# Altium schematic sheet RS485_RS232_Sheet.SchDoc
size 420 x 297 mm; SheetNumber: 5; SheetTotal: 10
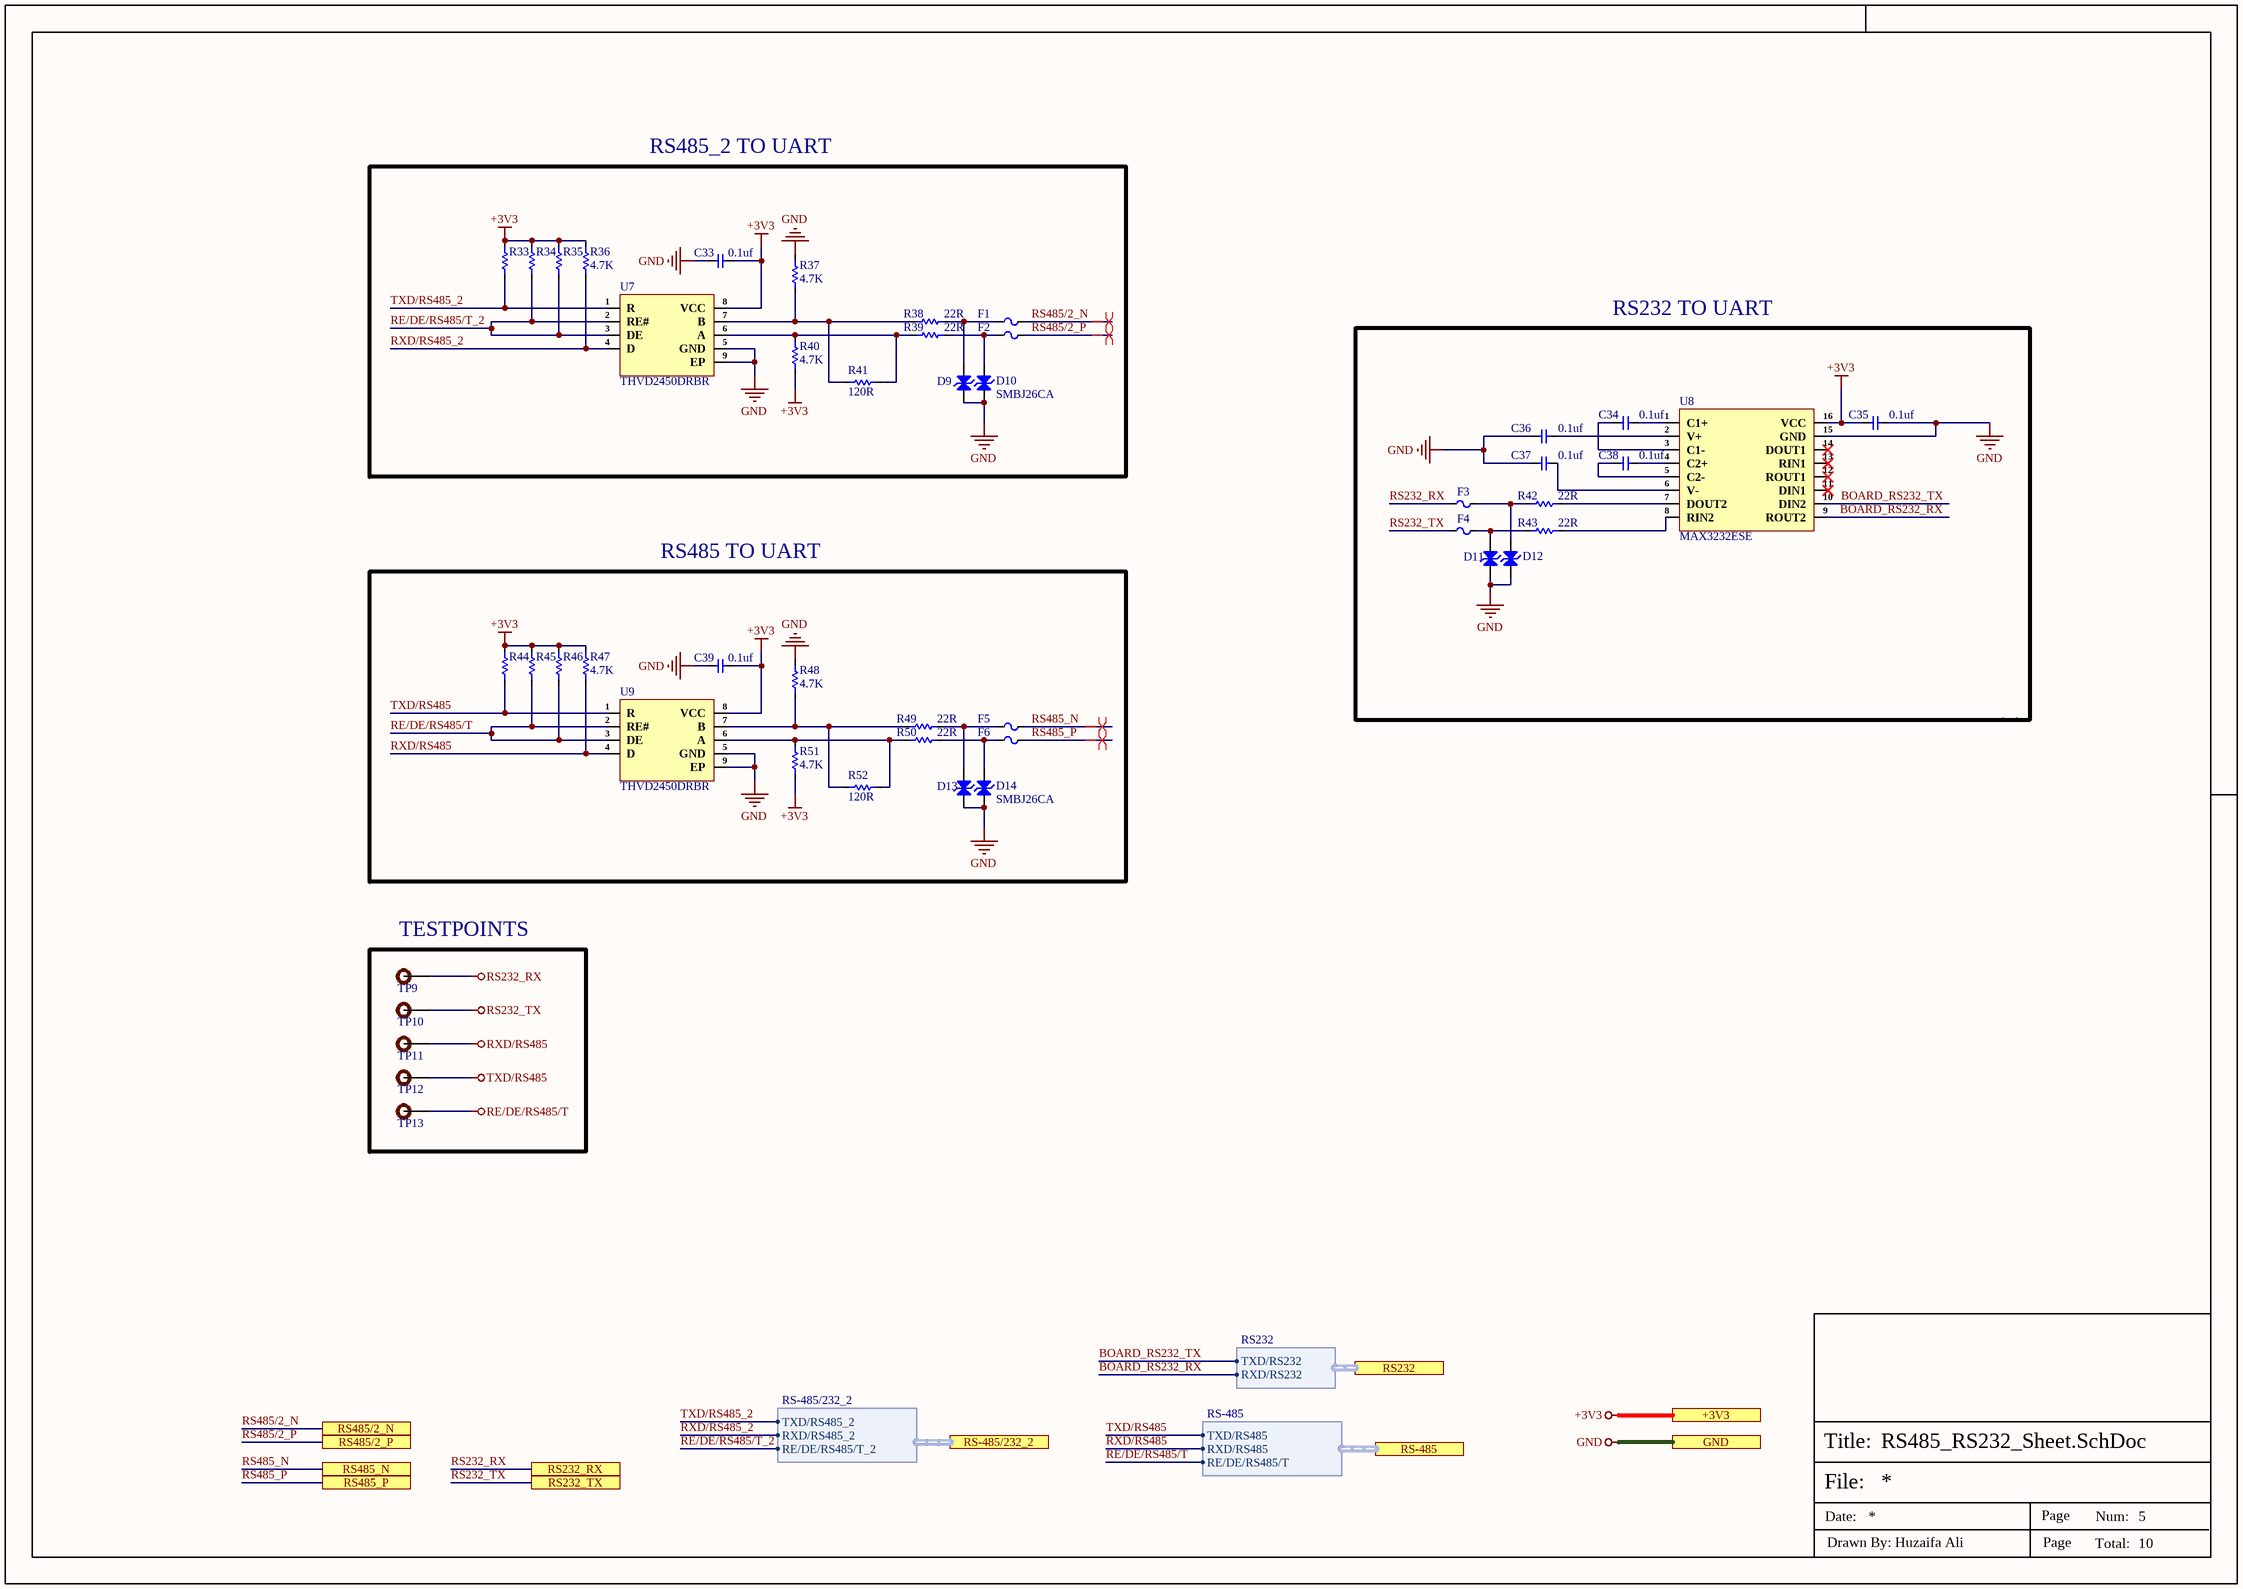
[diagram p0: RS485_RS232_Sheet.SchDoc]

## Parts
C33  0.1uf  [Cap-0402]
C34  0.1uf  [Cap-0402]
C35  0.1uf  [Cap-0402]
C36  0.1uf  [Cap-0402]
C37  0.1uf  [Cap-0402]
C38  0.1uf  [Cap-0402]
C39  0.1uf  [Cap-0402]
D9  SMBJ26CA  [SMB Bi Directional]  (value not drawn)
D10  SMBJ26CA  [SMB Bi Directional]
D11  SMBJ26CA  [SMB Bi Directional]  (value not drawn)
D12  SMBJ26CA  [SMB Bi Directional]  (value not drawn)
D13  SMBJ26CA  [SMB Bi Directional]  (value not drawn)
D14  SMBJ26CA  [SMB Bi Directional]
F1  SMD0805P020TF  [Fuse-0805]  (value not drawn)
F2  SMD0805P020TF  [Fuse-0805]  (value not drawn)
F3  SMD0805P020TF  [Fuse-0805]  (value not drawn)
F4  SMD0805P020TF  [Fuse-0805]  (value not drawn)
F5  SMD0805P020TF  [Fuse-0805]  (value not drawn)
F6  SMD0805P020TF  [Fuse-0805]  (value not drawn)
R33  4.7K  [Res-0402]  (value not drawn)
R34  4.7K  [Res-0402]  (value not drawn)
R35  4.7K  [Res-0402]  (value not drawn)
R36  4.7K  [Res-0402]
R37  4.7K  [Res-0402]
R38  22R  [Res-0201]
R39  22R  [Res-0201]
R40  4.7K  [Res-0402]
R41  120R  [Res-0603]
R42  22R  [Res-0201]
R43  22R  [Res-0201]
R44  4.7K  [Res-0402]  (value not drawn)
R45  4.7K  [Res-0402]  (value not drawn)
R46  4.7K  [Res-0402]  (value not drawn)
R47  4.7K  [Res-0402]
R48  4.7K  [Res-0402]
R49  22R  [Res-0201]
R50  22R  [Res-0201]
R51  4.7K  [Res-0402]
R52  120R  [Res-0603]
TP9  TEST POINT  [Test-point]  (value not drawn)  (no BOM)
TP10  TEST POINT  [Test-point]  (value not drawn)  (no BOM)
TP11  TEST POINT  [Test-point]  (value not drawn)  (no BOM)
TP12  TEST POINT  [Test-point]  (value not drawn)  (no BOM)
TP13  TEST POINT  [Test-point]  (value not drawn)  (no BOM)
U7  THVD2450DRBR  [SON-8-EP(3x3)]
U8  MAX3232ESE  [SOP-16]
U9  THVD2450DRBR  [SON-8-EP(3x3)]

## Ports
+3V3 (see Top_Sheet[3B], CAN_Sheet[5D], Controller_Sheet[5D], EtherCAT_Sheet[5D], Power_Sheet[5D], RJ45_Sheet[5D]), GND (see Top_Sheet[3C], CAN_Sheet[5D], Connector_Sheet[5D], Controller_Sheet[5D], EtherCAT_Sheet[5D], Power_Sheet[5D], Relay_Sheet[5D], RJ45_Sheet[5D]), RS232 (harness RS232, see Top_Sheet[4B], Controller_Sheet[4D]), RS232_RX (see Top_Sheet[4C], Connector_Sheet[2D]), RS232_TX (see Top_Sheet[4C], Connector_Sheet[2D]), RS485/2_N (see Top_Sheet[3C], Connector_Sheet[2D]), RS485/2_P (see Top_Sheet[3C], Connector_Sheet[2D]), RS485_N (see Top_Sheet[4C], Connector_Sheet[2D]), RS485_P (see Top_Sheet[4C], Connector_Sheet[2D]), RS-485 (harness RS-485, see Top_Sheet[4C], Controller_Sheet[4D]), RS-485/232_2 (harness RS-485/232_2, see Top_Sheet[4C], Controller_Sheet[3D])

## Harnesses
RS-485: TXD/RS485, RXD/RS485, RE/DE/RS485/T
RS-485/232_2: TXD/RS485_2, RXD/RS485_2, RE/DE/RS485/T_2
RS232: TXD/RS232, RXD/RS232

## Nets
+3V3: C33.2 C35.2 C39.2 R33.2 R34.2 R35.2 R36.2 R40.1 R44.2 R45.2 R46.2 R47.2 R51.1 U7.8(VCC) U8.16(VCC) U9.8(VCC) ; port +3V3
GND: C33.1 C35.1 C36.1 C37.1 C39.1 D9.1(A) D10.1(A) D11.1(A) D12.1(A) D13.1(A) D14.1(A) R37.2 R48.2 U7.5(GND) U7.9(EP) U8.15(GND) U9.5(GND) U9.9(EP) ; port GND
RE/DE/RS485/T: R45.1 R46.1 TP13.1 U9.2(RE#) U9.3(DE) ; port RS-485.RE/DE/RS485/T
RS232_RX: F3.1 TP9.1 ; port RS232_RX
RS232_TX: F4.1 TP10.1 ; port RS232_TX
RXD/RS485: R47.1 TP11.1 U9.4(D) ; port RS-485.RXD/RS485
TXD/RS485: R44.1 TP12.1 U9.1(R) ; port RS-485.TXD/RS485
BOARD_RS232_RX: U8.9(ROUT2) ; port RS232.RXD/RS232
BOARD_RS232_TX: U8.10(DIN2) ; port RS232.TXD/RS232
RE/DE/RS485/T_2: R34.1 R35.1 U7.2(RE#) U7.3(DE) ; port RS-485/232_2.RE/DE/RS485/T_2
RS485/2_N: F1.2 ; port RS485/2_N
RS485/2_P: F2.2 ; port RS485/2_P
RS485_N: F5.2 ; port RS485_N
RS485_P: F6.2 ; port RS485_P
RXD/RS485_2: R36.1 U7.4(D) ; port RS-485/232_2.RXD/RS485_2
TXD/RS485_2: R33.1 U7.1(R) ; port RS-485/232_2.TXD/RS485_2
NetC34_1: C34.1 U8.1(C1+)
NetC34_2: C34.2 U8.3(C1-)
NetC36_2: C36.2 U8.2(V+)
NetC37_2: C37.2 U8.6(V-)
NetC38_1: C38.1 U8.4(C2+)
NetC38_2: C38.2 U8.5(C2-)
NetD9_2: D9.2(K) F1.1 R38.2
NetD10_2: D10.2(K) F2.1 R39.2
NetD11_2: D11.2(K) F4.2 R43.1
NetD12_2: D12.2(K) F3.2 R42.1
NetD13_2: D13.2(K) F5.1 R49.2
NetD14_2: D14.2(K) F6.1 R50.2
NetR37_1: R37.1 R38.1 R41.1 U7.7(B)
NetR39_1: R39.1 R40.2 R41.2 U7.6(A)
NetR42_2: R42.2 U8.7(DOUT2)
NetR43_2: R43.2 U8.8(RIN2)
NetR48_1: R48.1 R49.1 R52.1 U9.7(B)
NetR50_1: R50.1 R51.2 R52.2 U9.6(A)

Not connected (* = marked no-connect by the designer): U8 11(DIN1)* 12(ROUT1)* 13(RIN1)* 14(DOUT1)*

## Layout directives
differential pair; net class RS485; differential pair class RS485_LINES; rule Impedance Constraint [Min = 115.0    Max = 125.0    ]; rule Matched Net Lengths [Tolerance = 0.508mm]: RS485/2_N, RS485/2_P, RS485_N, RS485_P

## Notes on the sheet
- RS485_2 TO UART
- RS232 TO UART
- RS485 TO UART
- (near TP9) TESTPOINTS
- File:
- Title:
- Date:
- Page
- Num:
- Total:
- Drawn By: Huzaifa Ali

## Library data of the parts
C33-C39 = GRM155R62A104KE14D: CAP CER 0.1UF 100V X5R 0402; Manufacturer: Murata; Capacitance: 100nF; Tolerance: 10%; Item Type: Capacitor; Supplier 1: Arrow Electronics; Manufacturer Part Number: GRM155R62A104KE14D; RoHS: Yes; Category: Ceramic Capacitors; Stock 1: 870000; Pricing 1: 10000=0.00500, 20000=0.00410, 30000=0.00390, 50000=0.00370, 100000=0.00300 (USD); Mount: Surface Mount; Case/Package: 0402; Case Code (Metric): 1005; Case Code (Imperial): 0402; Weight: 0.000212oz; Min Operating Temperature: -55°C; Max Operating Temperature: 85°C; Packaging: Tape and Reel; Voltage Rating: 100V; Dielectric: X5R; Termination: SMD/SMT; Voltage Rating (DC): 100V; Package Quantity: 10000; Series: GRM; Length: 0.039inch; Width: 0.02inch; Height: 0.5mm; Thickness: 0.022inch; Reach SVHC Compliant: Yes; Lead Free: Lead Free; RoHS Compliant: Yes; ComponentLink1URL: http://www.farnell.com/datasheets/2079151.pdf?src-supplier=Farnell; ComponentLink1Description: http://www.farnell.com/datasheets/2079151.pdf?src-supplier=Farnell; ComponentLink2URL: http://www.mouser.com/ds/2/281/c02e-2905.pdf?src-supplier=Mouser; ComponentLink2Description: http://www.mouser.com/ds/2/281/c02e-2905.pdf?src-supplier=Mouser; ComponentLink3URL: http://www.farnell.com/datasheets/2079151.pdf?src-supplier=Element14; ComponentLink3Description: http://www.farnell.com/datasheets/2079151.pdf?src-supplier=Element14; ComponentLink4URL: http://search.murata.co.jp/Ceramy/image/img/A01X/G101/ENG/GRM155R62A104KE14-01.pdf?src-supplier=Digi-Key; ComponentLink4Description: http://search.murata.co.jp/Ceramy/image/img/A01X/G101/ENG/GRM155R62A104KE14-01.pdf?src-supplier=Digi-Key; ComponentLink5URL: http://www.farnell.com/datasheets/2079151.pdf?src-supplier=Newark; ComponentLink5Description: http://www.farnell.com/datasheets/2079151.pdf?src-supplier=Newark; Supplier Part Number 1: GRM155R62A104KE14D; LCSC Part Number: C162178
D9-D14 = SMBJ26CA: SMB(DO-214AA) TVS ROHS; Manufacturer: MSKSEMI; Item Type: Diode; Manufacturer Part Number: SMBJ26CA; Package: SMB(DO-214AA); LCSC Part Number: C5331111; ComponentLink1Description: LCSC; ComponentLink1URL: https://www.lcsc.com/product-detail/TVS_MSKSEMI-SMBJ26CA_C5331111.html
F1-F6 = SMD0805P020TF: 9V 200mA 100A 500mA 0805 Resettable Fuses ROHS; Manufacturer: RUILON; Item Type: Fuse; Manufacturer Part Number: SMD0805P020TF; Package: 0805; LCSC Part Number: C20976; ComponentLink1Description: LCSC; ComponentLink1URL: https://www.lcsc.com/product-detail/Resettable-Fuses_RUILON-Shenzhen-Ruilongyuan-Elec-SMD0805P020TF_C20976.html
R33-R37 R40 R44-R48 R51 = RC0402FR-074K7L: RES 4.7K OHM 1% 1/16W 0402; Manufacturer: Yageo; Voltage Rating (DC): 50V; Power Rating: 62.5mW; Resistance: 4.7kR; Temperature Coefficient: 100ppm/°C; Max Power Dissipation: 63mW; Item Type: Resistor; Supplier 1: Avnet; Manufacturer Part Number: RC0402FR-074K7L; RoHS: Yes; Category: Chip SMD Resistors; Stock 1: 2420000; Pricing 1: 10000=0.00085 (USD); Case/Package: 0402; Number of Pins: 2; Case Code (Imperial): 0402; Case Code (Metric): 1005; Size Code: 0402; Min Operating Temperature: -55°C; Max Operating Temperature: 155°C; Tolerance: 1%; Voltage Rating: 50V; Packaging: Tape and Reel; Resistor Type: Thick Film; Termination: SMD/SMT; Features: Moisture Resistant; Series: RC; Number of Terminations: 2; Resistance Tolerance: 1%; Construction: Rectangular; Length: 1mm; Width: 0.5mm; Height: 0.32mm; Depth: 0.5mm; Height - Seated (Max): 0.016inch; RoHS Compliant: Yes; Reach SVHC Compliant: Yes; Military Standard: Not; Lead Free: Lead Free; ComponentLink1URL: https://datasheet.ciiva.com/22661/1686128-22661342.pdf?src-supplier=Element14; ComponentLink1Description: https://datasheet.ciiva.com/22661/1686128-22661342.pdf?src-supplier=Element14; ComponentLink2URL: https://datasheet.ciiva.com/7850/1018594-7850022.pdf?src-supplier=Element14; ComponentLink2Description: https://datasheet.ciiva.com/7850/1018594-7850022.pdf?src-supplier=Element14; ComponentLink3URL: https://datasheet.ciiva.com/7850/1018594-7850023.pdf?src-supplier=Element14; ComponentLink3Description: https://datasheet.ciiva.com/7850/1018594-7850023.pdf?src-supplier=Element14; ComponentLink4URL: https://datasheet.ciiva.com/15215/getdatasheetpartid-328119-15215035.pdf?src-supplier=Verical; ComponentLink4Description: https://datasheet.ciiva.com/15215/getdatasheetpartid-328119-15215035.pdf?src-supplier=Verical; Supplier Part Number 1: RC0402FR-074K7L; LCSC Part Number: C105871
R38 R39 R42 R43 R49 R50 = RC0201FR-0722RL: RES 22 OHM 1% 1/20W 0201; Manufacturer: Yageo; Item Type: Resistor; Supplier: Future Electronics; Supplier Part Number: 5973409; Manufacturer Part Number: RC0201FR-0722RL; RoHS: Yes; Category: Chip SMD Resistors; Stock: 17980000; Pricing: 10000=0.0014, 50000=0.0013, 250000=0.0013, 750000=0.0012, 2000000=0.0011 (USD); ComponentLink1URL: https://datasheet.ciiva.com/7672/1563626-7672215.pdf?src-supplier=Element14; ComponentLink1Description: https://datasheet.ciiva.com/7672/1563626-7672215.pdf?src-supplier=Element14; LCSC Part Number: C155743
R41 R52 = RC0603JR-07120RL: RES 120 OHM 5% 1/10W 0603; Manufacturer: Yageo; Voltage Rating (AC): 50V; Item Type: Resistor; Supplier: Future Electronics; Supplier Part Number: 4045720; Manufacturer Part Number: RC0603JR-07120RL; RoHS: Yes; Category: Chip SMD Resistors; Stock: 570000; Pricing: 5000=0.0015, 75000=0.0015, 250000=0.0014, 750000=0.0013, 2500000=0.0012 (USD); ComponentLink1URL: https://datasheet.ciiva.com/15189/getdatasheetpartid-326532-15189850.pdf?src-supplier=Verical; ComponentLink1Description: https://datasheet.ciiva.com/15189/getdatasheetpartid-326532-15189850.pdf?src-supplier=Verical; ComponentLink2URL: https://datasheet.ciiva.com/2518/pyu-r-int-thick-7-2518850.pdf?src-supplier=Digi-Key; ComponentLink2Description: https://datasheet.ciiva.com/2518/pyu-r-int-thick-7-2518850.pdf?src-supplier=Digi-Key; ComponentLink3URL: https://datasheet.ciiva.com/2518/pyu-r-int-thick-7-2518851.pdf?src-supplier=Digi-Key; ComponentLink3Description: https://datasheet.ciiva.com/2518/pyu-r-int-thick-7-2518851.pdf?src-supplier=Digi-Key; ComponentLink4URL: https://datasheet.ciiva.com/2518/pyu-r-int-thick-7-2518852.pdf?src-supplier=Digi-Key; ComponentLink4Description: https://datasheet.ciiva.com/2518/pyu-r-int-thick-7-2518852.pdf?src-supplier=Digi-Key; ComponentLink5URL: https://datasheet.ciiva.com/46395/443971-46395070.pdf?src-supplier=Element14; ComponentLink5Description: https://datasheet.ciiva.com/46395/443971-46395070.pdf?src-supplier=Element14; ComponentLink6URL: https://datasheet.ciiva.com/12555/rc0603-272842-12555246.pdf?src-supplier=Mouser; ComponentLink6Description: https://datasheet.ciiva.com/12555/rc0603-272842-12555246.pdf?src-supplier=Mouser; LCSC Part Number: C114681
TP9-TP13 = TEST POINT: Test Point ON; Item Type: TEST POINT
U7 U9 = THVD2450DRBR: IC TRANSCEIVER HALF 1/1 8SON; Manufacturer: Texas Instruments; Supplier: Digikey; Supplier Part Number: 296-THVD2450DRBRCT-ND; Manufacturer Part Number: THVD2450DRBR; RoHS: Yes; Item Type: IC; Stock: 2652; Pricing: 1=4.05, 10=3.639, 25=3.4404, 100=2.9818, 250=2.82892, 500=2.53838, 1000=2.1408 (USD); Pins: 8NUMBER; Length: 3mm; Width: 3mm; Height: 1mm; Thickness: 880um; LCSC Part Number: C2878080
U8 = MAX3232ESE: 250Kbps transceiver 2/2 SOP-16 RS232 ICs ROHS; Manufacturer: UMW; Item Type: IC; Manufacturer Part Number: MAX3232ESE; Package: SOP-16; LCSC Part Number: C2904738; ComponentLink1Description: LCSC; ComponentLink1URL: https://www.lcsc.com/product-detail/RS232-ICs_UMW-Youtai-Semiconductor-Co-Ltd-MAX3232ESE_C2904738.html